# Altium schematic sheet USB.SchDoc
size B; Organization: Altium Limited; Address1: L3, 12a Rodborough Rd; Address2: Frenchs Forest; Address3: NSW; Address4: Australia 2086
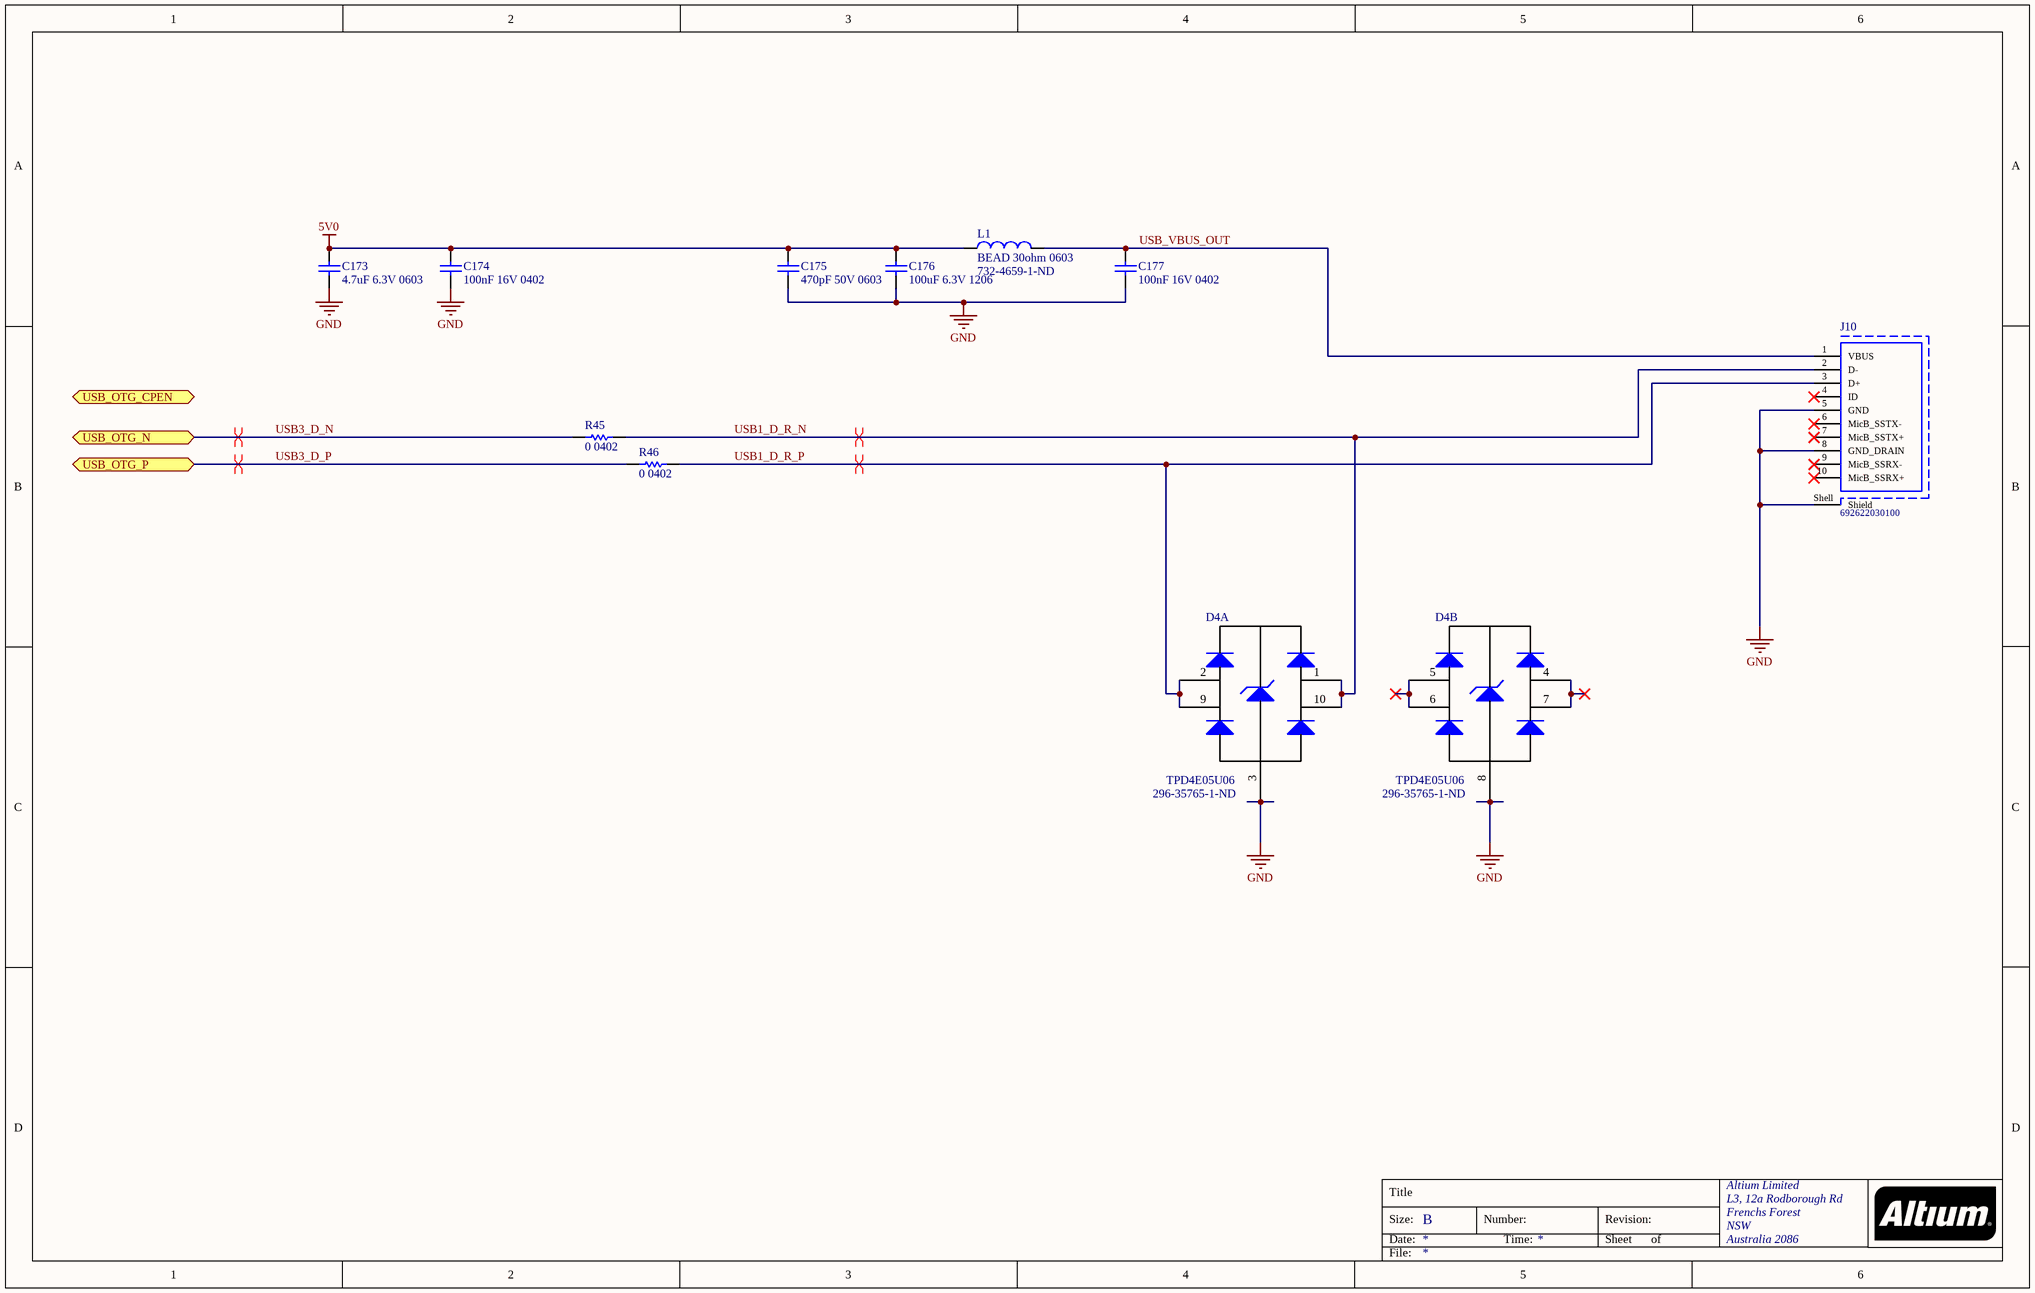
[diagram p0: USB.SchDoc]

## Parts
C173  4.7uF 6.3V 0603  [CAPC0603(1608)55_M]
C174  100nF 16V 0402  [CAPC0402(1005)60_M]
C175  470pF 50V 0603  [CAPC0603(1608)100_M]
C176  100uF 6.3V 1206  [CAPC1206(3216)190_L]
C177  100nF 16V 0402  [CAPC0402(1005)60_M]
D4  TPD4E05U06  Supplier Part Number 1: 296-35765-1-ND  [TI R-PUSON-N10]  (parts A,B of 2)
J10  692622030100  [692622030100]
L1  BEAD 30ohm 0603  Supplier Part Number 1: 732-4659-1-ND  [WE BEAD 0603 INDC1608X10N]
R45  0 0402  [RESC0402(1005)_N]
R46  0 0402  [RESC0402(1005)_N]

## Ports
USB_OTG_CPEN (bidir), USB_OTG_N (bidir), USB_OTG_P (bidir)

## Nets
5V0: C173.2 C174.2 C175.2 C176.2 L1.1
GND: C173.1 C174.1 C175.1 C176.1 C177.1 D4.3 D4.8 J10.5(GND) J10.8(GND_DRAIN) J10.Shell(Shield)
USB1_D_R_N: D4.1 D4.10 J10.2(D-) R45.2
USB1_D_R_P: D4.2 D4.9 J10.3(D+) R46.2
USB3_D_N: R45.1 ; port USB_OTG_N
USB3_D_P: R46.1 ; port USB_OTG_P
USB_VBUS_OUT: C177.2 J10.1(VBUS) L1.2
NetD4_4: D4.4 D4.7
NetD4_5: D4.5 D4.6

Not connected (* = marked no-connect by the designer): J10 4(ID)* 6(MicB_SSTX-)* 7(MicB_SSTX+)* 9(MicB_SSRX-)* 10(MicB_SSRX+)*

## Layout directives
differential pair: USB1_D_R_N, USB1_D_R_P, USB3_D_N, USB3_D_P

## Notes on the sheet
- Title
- Size:
- Date:
- B
- Number:
- Time:
- Revision:
- Sheet
- of
- File:

## Library data of the parts
C173 = CMP-1035-02779-1: CAP 4.7uF 6.3V ±10% 0603 (1608 Metric) Thickness 0.55mm SMD; Case-Metric: 1608; Case-EIA: 0603; Tolerance: Â±10%; Technology: SMT; Value: 4.7uF; Max Thickness: 0.55 mm; Rated Voltage: 6.3 V
C174 C177 = CMP-1034-02069-1: CAP 100nF 16V ±10% 0402 (1005 Metric) Thickness 0.6mm SMD; Case-EIA: 0402; Case-Metric: 1005; Tolerance: Â±10%; Value: 100nF; Max Thickness: 0.6 mm; Rated Voltage: 16 V; Technology: SMT
C175 = CMP-1035-01675-1: CAP 470pF 50V ±5% 0603 (1608 Metric) Thickness 1mm SMD; Case-Metric: 1608; Tolerance: Â±5%; Case-EIA: 0603; Technology: SMT; Rated Voltage: 50 V; Max Thickness: 1 mm; Value: 470pF
C176 = CMP-1037-05005-1: CAP 100uF 6.3V ±20% 1206 (3216 Metric) Thickness 1.9mm SMD; Tolerance: Â±20%; Case-EIA: 1206; Case-Metric: 3216; Technology: SMT; Max Thickness: 1.9 mm; Rated Voltage: 6.3 V; Value: 100uF
D4 = TPD4E05U06: 4-Channel ESD Protection Diode; Supplier 1: Digi-Key
J10 = CMP-1502-03225-1: Micro USB 3.0 Type B Receptacle WR-COM, Horizontal, SMT, with Pads; Manufacturer: Wurth Elektronik; Contact Resistance: 50mOhm; Rated Current: 0.25A; Working Voltage: 30VAC; Manufacturer URL: http://www.we-online.de; Connector Type: MicroUSB3.0TypeB; Gender: Receptacle; Part Number: 692622030100; Mounting Technology: SMT; Packaging: TapeandReel; Publisher: WurthElektronik; Orientation: Horizontal; Package Reference: 692622030100; Operating Temperature: -20to85degC; Datasheet URL: https://katalog.we-online.de/em/datasheet/692622030100.pdf
L1 = BEAD 30ohm 0603: Ferrite bead, 30ohm @ 100MHz; Supplier 1: Digi-Key
R45 R46 = CMP-1011-00001-1: Jumper 0402 (1005 Metric); Tolerance: None; Case-Metric: 1005; Case-EIA: 0402; Value: 0.00 Ohm; Power: None; Technology: SMT